# EAGLE design FSAE (EAGLE 8.3.1)
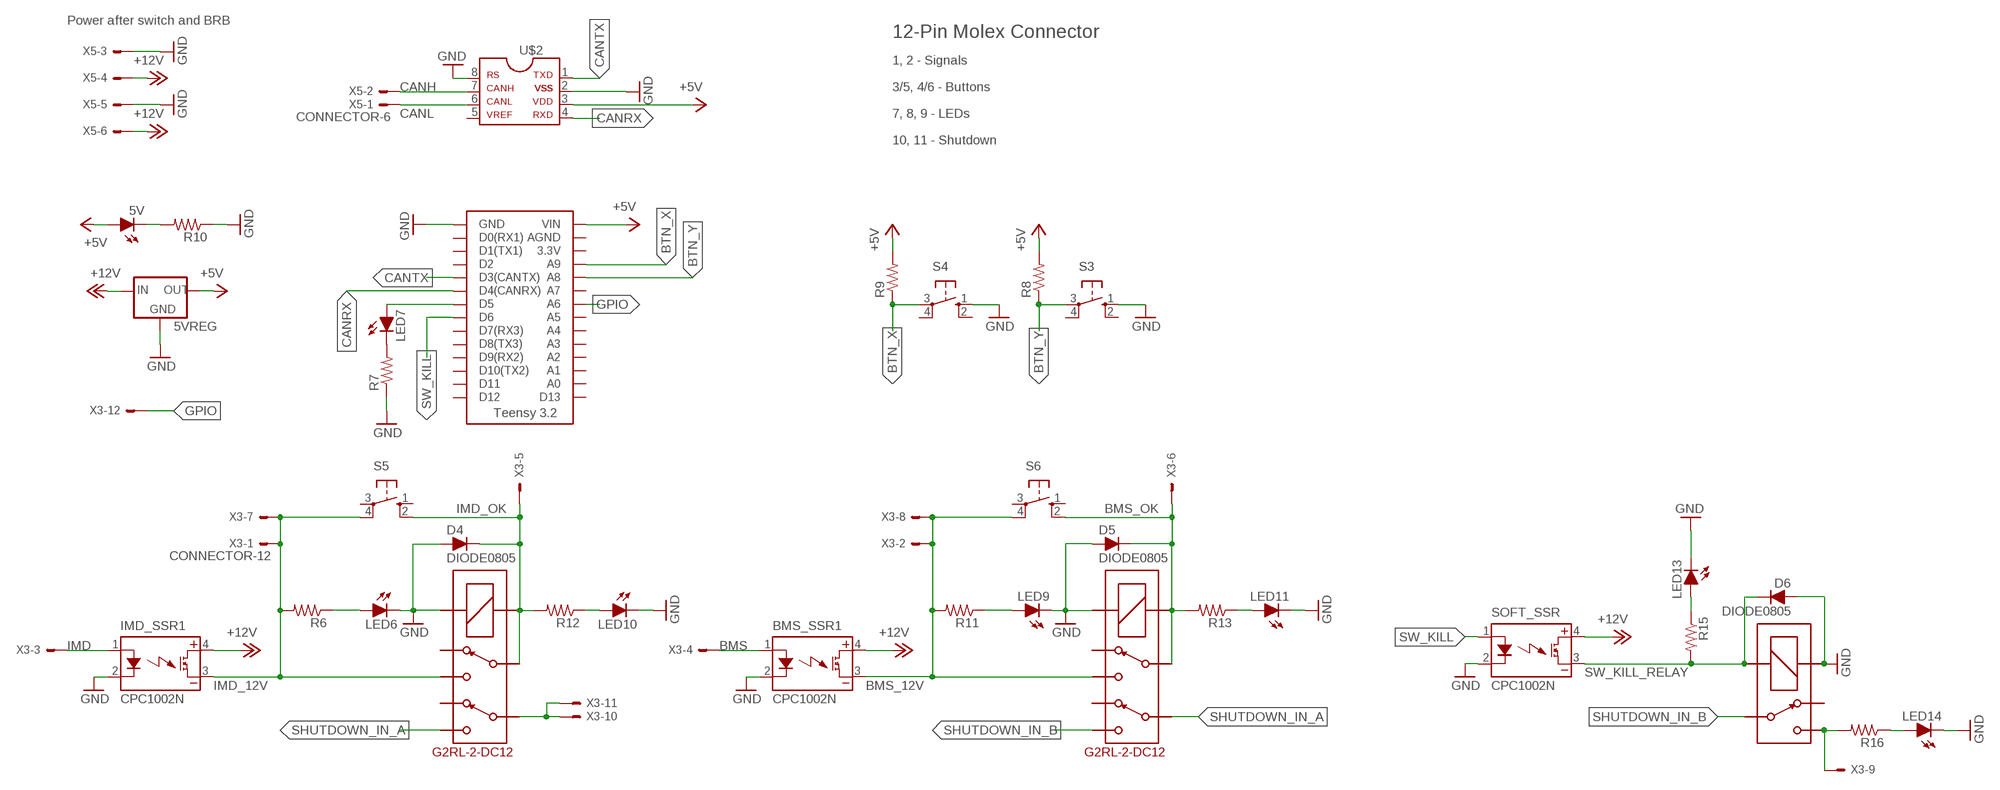
[diagram p0: schematic, sheet 1]

## Parts
5V  LED-0805  [LED-805]
5VREG  5VREG_LM340-NLM340MPX-5.0/NOPB  [SOT223]
BMS_SSR1  CPC1002N  [SOP04]
D4  DIODE0805  [0805_D]
D5  DIODE0805  [0805_D]
D6  DIODE0805  [0805_D]
IMD_SSR1  CPC1002N  [SOP04]
LED6  LED-0805  [LED-805]
LED7  LED-0805  [LED-805]
LED9  LED-0805  [LED-805]
LED10  LED-0805  [LED-805]
LED11  LED-0805  [LED-805]
LED13  LED-0805  [LED-805]
LED14  LED-0805  [LED-805]
R6  RESISTOR0805-RES  [0805]
R7  RESISTOR0805-RES  [0805]
R8  RESISTOR0402  [0402-RES]
R9  RESISTOR0402  [0402-RES]
R10  RESISTOR0805-RES  [0805]
R11  RESISTOR0805-RES  [0805]
R12  RESISTOR0805-RES  [0805]
R13  RESISTOR0805-RES  [0805]
R15  RESISTOR0805-RES  [0805]
R16  RESISTOR0805-RES  [0805]
S3  BTN_10-XX  [B3F-10XX]
S4  BTN_10-XX  [B3F-10XX]
S5  BTN_10-XX  [B3F-10XX]
S6  BTN_10-XX  [B3F-10XX]
SOFT_SSR  CPC1002N  [SOP04]
U$1  TEENSY_3.2_SIMPLE  [TEENSY_3.2_SIMPLE]
U$2  MCP2551  [SOIC-08]
U$6  G2RL-2-DC12  [G2RL-2]
U$7  G2RL-2-DC12  [G2RL-2]
U$8  G5LE  [ZF112]
X3  CONNECTOR-12  [MINIFIT_5566-12]
X5  CONNECTOR-6  [MINIFIT_5566-6]

## Nets
+5V: 5V.A 5VREG.3(OUT) R8.2 R9.2 U$1.VIN U$2.3
+12V: 5VREG.1(IN) BMS_SSR1.4(DC+) IMD_SSR1.4(DC+) SOFT_SSR.4(DC+) X5.4 X5.6
BMS: BMS_SSR1.1(CONTROL+) X3.4
BMS_12V: BMS_SSR1.3(DC-) R11.2 S6.4(P1) U$7.4 X3.2 X3.8
BMS_OK: D5.C R13.2 S6.2(S1) U$7.3 U$7.COIL- X3.6
BTN_X: R9.1 S4.3(P) U$1.A9
BTN_Y: R8.1 S3.3(P) U$1.A8
CANH: U$2.7 X5.2
CANL: U$2.6 X5.1
CANRX: U$1.D4(CANRX) U$2.4
CANTX: U$1.D3(CANTX) U$2.1
GND: 5VREG.2(GND) 5VREG.4(GND) BMS_SSR1.2(CONTROL-) D4.A D5.A D6.A IMD_SSR1.2(CONTROL-) LED6.C LED9.C LED10.C LED11.C LED13.C LED14.C R7.1 R10.1 S3.1(S) S4.1(S) SOFT_SSR.2(CONTROL-) U$1.GND U$2.2 U$2.8 U$6.COIL+ U$7.COIL+ U$8.1(COIL+) X5.3 X5.5
GPIO: U$1.A6 X3.12
IMD: IMD_SSR1.1(CONTROL+) X3.3
IMD_12V: IMD_SSR1.3(DC-) R6.2 S5.4(P1) U$6.4 X3.1 X3.7
IMD_OK: D4.C R12.2 S5.2(S1) U$6.3 U$6.COIL- X3.5
N$2: LED7.A U$1.D5
N$3: 5V.C R10.2
N$4: U$6.6 X3.10 X3.11
N$6: LED6.A R6.1
N$7: LED9.A R11.1
N$8: LED10.A R12.1
N$10: LED7.C R7.2
N$12: LED11.A R13.1
N$13: LED14.A R16.1
N$14: LED13.A R15.1
SHUTDOWN_IN_A: U$6.5 U$7.6
SHUTDOWN_IN_B: U$7.5 U$8.P
SHUTDOWN_OUT: R16.2 U$8.S X3.9
SW_KILL: SOFT_SSR.1(CONTROL+) U$1.D6
SW_KILL_RELAY: D6.C R15.2 SOFT_SSR.3(DC-) U$8.2(COIL-)
Unconnected: S3.2(S1) S3.4(P1) S4.2(S1) S4.4(P1) S5.1(S) S5.3(P) S6.1(S) S6.3(P) U$1.3.3V U$1.A0 U$1.A1 U$1.A2 U$1.A3 U$1.A4 U$1.A5 U$1.A7 U$1.AGND U$1.D0(RX1) U$1.D1(TX1) U$1.D2 U$1.D7(RX3) U$1.D8(TX3) U$1.D9(RX2) U$1.D10(TX2) U$1.D11 U$1.D12 U$1.D13 U$2.5 U$6.2 U$6.7 U$7.2 U$7.7 U$8.O

## Notes on the sheet
- Power after switch and BRB
- 12-Pin Molex Connector
- 1, 2 - Signals
- 3/5, 4/6 - Buttons
- 7, 8, 9 - LEDs
- 10, 11 - Shutdown

## Library data of the parts
5V LED6 LED7 LED9-LED11 LED13 LED14 = HyTechDevices:LED: Light Emitting Diode (LED) Source: Dangerous Prototypes Eagle Library <https://github.com/DangerousPrototypes/Eagle_Part_Library>
5VREG = HyTechDevices:5VREG_LM340-N: Voltage Regulator 5v linear voltage regulator Datasheet <http://www.mouser.com/ProductDetail/Texas-Instruments/LM340MPX-50-NOPB/?qs=X1J7HmVL2ZGZwtTFRQ9ItA%3D%3D> MAX current out: 1.5A MAX voltage in: 35V
BMS_SSR1 IMD_SSR1 SOFT_SSR = HyTechDevices:CPC1002N: IXYS Solid State Relay .7A
D4-D6 = HyTechDevices:DIODE: DIODE general purpose rectifier
R6-R13 R15 R16 = HyTechDevices:RESISTOR: Resistor Basic schematic elements and footprints for 0603, 1206, and PTH resistors.
S3-S6 = HyTechDevices:BTN_10-XX: Small momentary tactile push button; MPN: B3F-1000; OC_FARNELL: 176432; OC_NEWARK: 36M3542
U$1 = HyTechDevices:TEENSY_3.2_SIMPLE: Simple version of the Teensy 3.2 board that only uses the 2 main rows of pins, not the inner pins or the pins opposite the usb port.
U$2 = HyTechDevices:MCP2551: MCP2551 High-Speed CAN Transceiver Product Webpage <https://www.microchip.com/wwwproducts/en/MCP2551> Datasheet <http://ww1.microchip.com/downloads/en/DeviceDoc/21667f.pdf> This device is outdated It is replaced by MCP2561. Comparison Page <https://www.microchip.com/wwwproducts/ProductCompare/MCP2551/MCP2561> Product Webpage <https://www.microchip.com/wwwproducts/en/MCP2561> Datasheet <http://ww1.microchip.com/downloads/en/DeviceDoc/20005167C.pdf>
U$6 U$7 = HyTechDevices:G2RL-2-DC12: Omron G2RL-2 Double Pull Double Throw Relay Coil Voltage: 12VDC (8.4-18VDC @60ºC) Contact Amperage: 8A at 30VDC Datasheet <https://www.omron.com/ecb/products/pdf/en-g2rl.pdf>
U$8 = HyTechDevices:G5LE: Omron G5LE SPST Relay 5 VDC, 12VDC, 24VDC models Coil voltage: 75% - 170% of nominal voltage Datasheet <https://www.omron.com/ecb/products/pdf/en-g5le.pdf>
X3 = HyTechDevices:CONNECTOR-12: Mini-Fit Junior connector 12 pole Source: http://www.molex.com; OC_FARNELL: unknown; OC_NEWARK: unknown
X5 = HyTechDevices:CONNECTOR-6: Mini-Fit Junior connector 6 pole Source: http://www.molex.com; MPN: 95566-61002; OC_FARNELL: unknown; OC_NEWARK: 22K8620

## Board
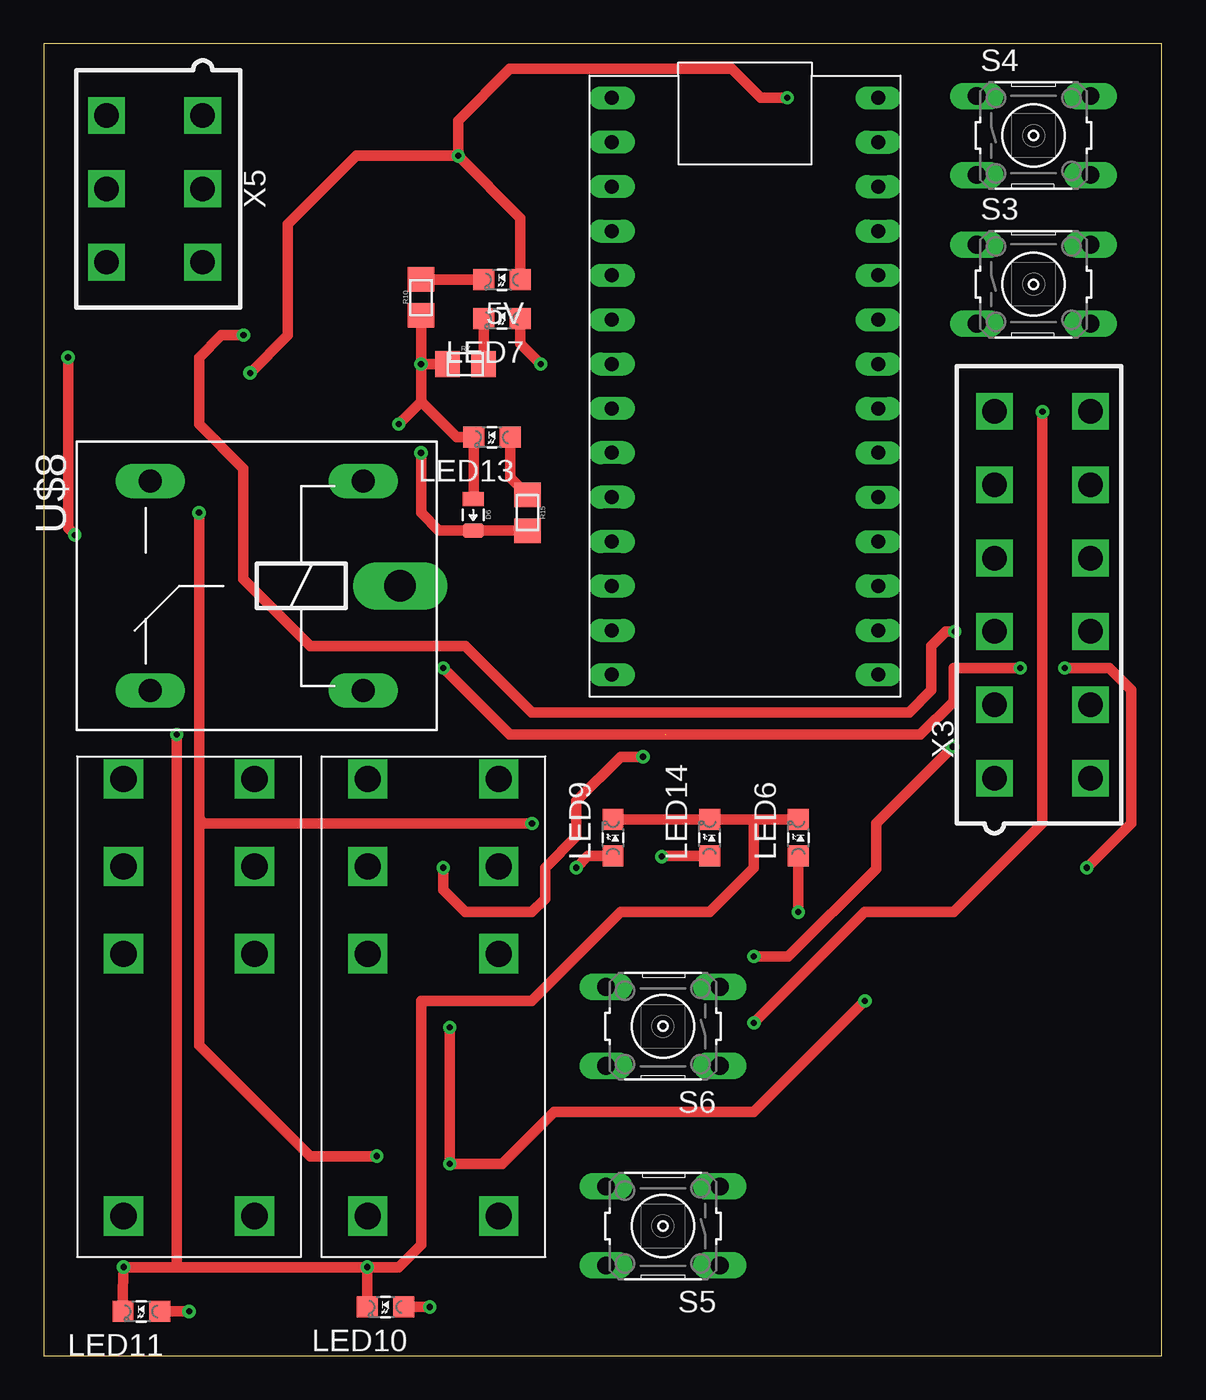
[diagram p1: board, top side]
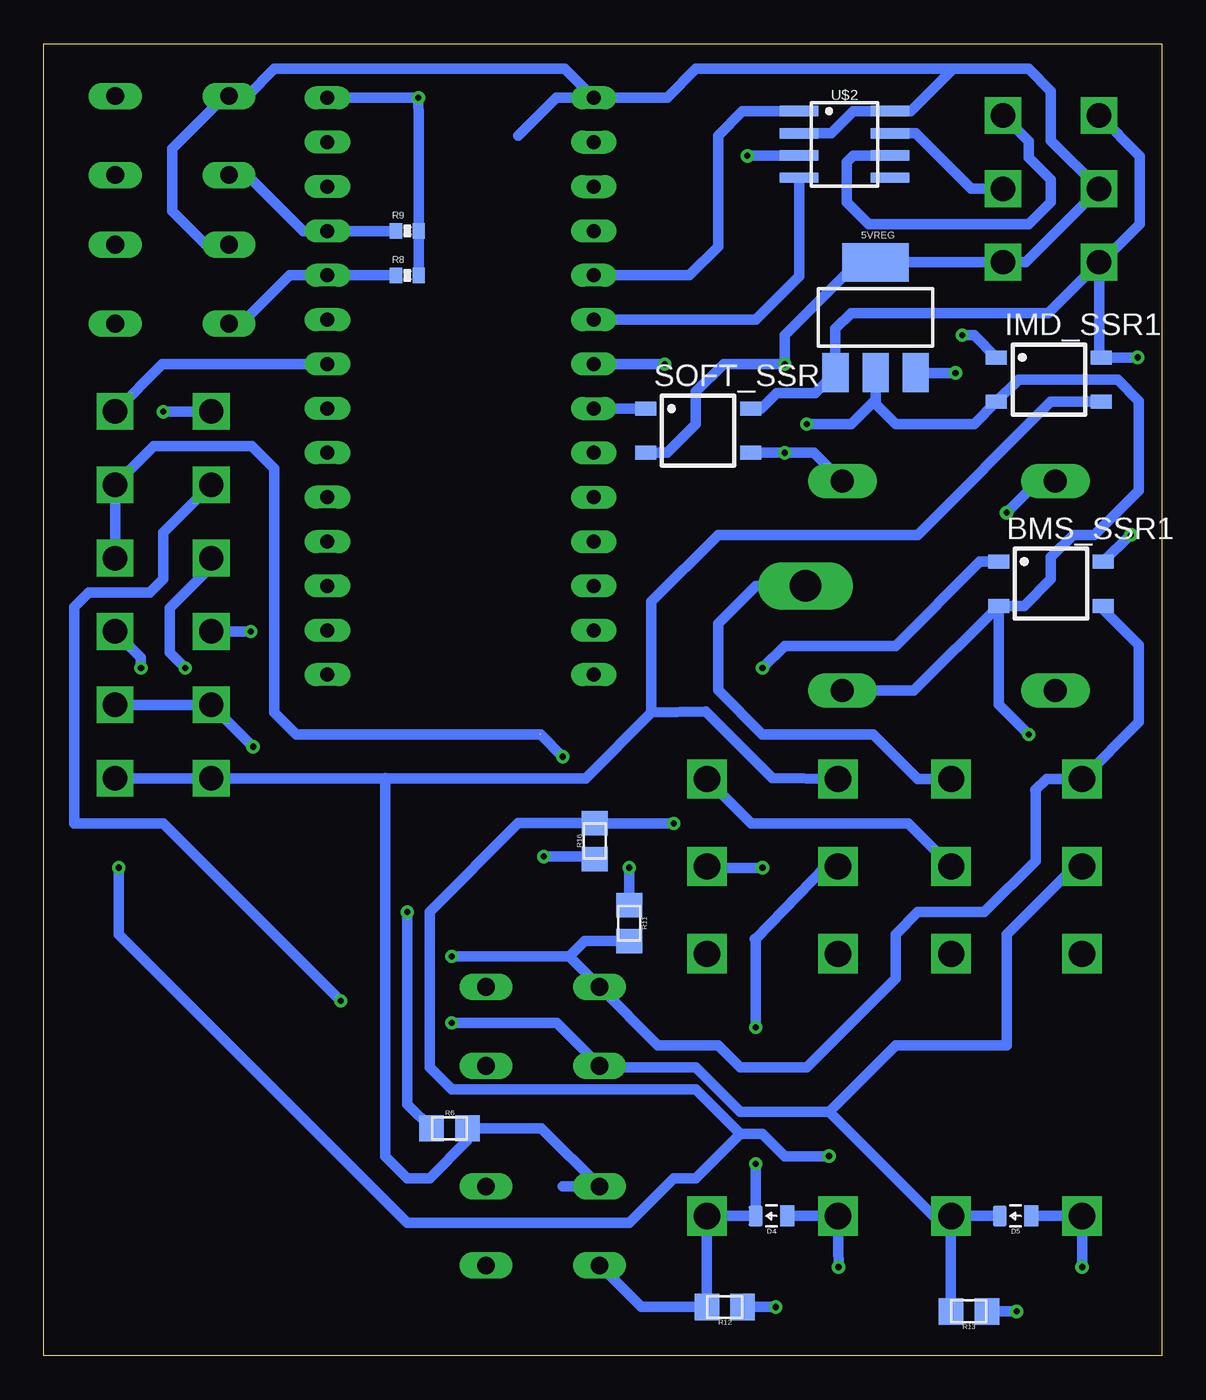
[diagram p2: board, bottom side, seen from below]

Size 63.99 x 75.11 mm. Coordinates in mm from the lower left corner, seen from the top.
Outline: 0,0 63.99,0 63.99,75.11 0,75.11 0,0
Copper layers (1*16): Top 0.035mm / dielectric 1.5mm / Bottom 0.035mm
Design rules "default": minimum track width 10mil, minimum drill 24mil, track to track 8mil, track to pad 8mil, pad to pad 8mil, via to via 8mil, smd to smd 8mil, copper to edge 40mil, drill to drill 8mil, minimum pad ring 10mil, minimum via ring 8mil, stop-mask expansion 4mil, vias tented up to drill 0mil, thermal gap 10mil

### Footprints (pad centres in the part's own frame; a part is rotated, then mirrored left to right if it is on the bottom)
LED-805 = smd 1.2 x 1.2: A 0,-1.05; C 0,1.05
SOT223 = smd 1.5 x 2.235: 1 -2.3,-3.15; 2 0,-3.15; 3 2.3,-3.15 | smd 3.8 x 2.2: 4 0,3.15
SOP04 = smd 0.8 x 1.2: 1 -1.27,-3; 2 1.27,-3; 3 1.27,3; 4 -1.27,3
0805_D = smd 0.8 x 1.2: A -0.9,0; C 0.9,0
0805 = smd 1.4 x 1.5: 1 -1.025,0; 2 1.025,0
0402-RES = smd 0.7 x 0.9: 1 -0.65,0; 2 0.65,0
B3F-10XX = drill 1.016 long: 1 -3.251,2.261; 2 3.251,2.261; 3 -3.251,-2.261; 4 3.251,-2.261
TEENSY_3.2_SIMPLE = drill 0.8 long: 3.3V 16.51,29.21; A0 16.51,3.81; A1 16.51,6.35; A2 16.51,8.89; A3 16.51,11.43; A4 16.51,13.97; A5 16.51,16.51; A6 16.51,19.05; A7 16.51,21.59; A8 16.51,24.13; A9 16.51,26.67; AGND 16.51,31.75; D0(RX1) 1.27,31.75; D1(TX1) 1.27,29.21; D2 1.27,26.67; D3(CANTX) 1.27,24.13; D4(CANRX) 1.27,21.59; D5 1.27,19.05; D6 1.27,16.51; D7(RX3) 1.27,13.97; D8(TX3) 1.27,11.43; D9(RX2) 1.27,8.89; D10(TX2) 1.27,6.35; D11 1.27,3.81; D12 1.27,1.27; D13 16.51,1.27; GND 1.27,34.29; VIN 16.51,34.29
SOIC-08 = smd 0.6 x 2.2: 1 -1.905,-2.6; 2 -0.635,-2.6; 3 0.635,-2.6; 4 1.905,-2.6; 5 1.905,2.6; 6 0.635,2.6; 7 -0.635,2.6; 8 -1.905,2.6
G2RL-2 = drill 1.5 square: 2 10.008,0; 3 5.004,0; 4 0,0; 5 0,7.493; 6 5.004,7.493; 7 10.008,7.493; COIL+ 25.019,0; COIL- 25.019,7.493
ZF112 = drill 1.321 long: 1 4.064,14.884; 2 4.064,2.896; O 16.256,14.884; S 16.256,2.896 | drill 1.803 long: P 1.956,8.89
MINIFIT_5566-12 = drill 1.4 square: 1 10.5,-2.75; 2 6.3,-2.75; 3 2.1,-2.75; 4 -2.1,-2.75; 5 -6.3,-2.75; 6 -10.5,-2.75; 7 10.5,2.75; 8 6.3,2.75; 9 2.1,2.75; 10 -2.1,2.75; 11 -6.3,2.75; 12 -10.5,2.75
MINIFIT_5566-6 = drill 1.4 square: 1 4.2,-2.75; 2 0,-2.75; 3 -4.2,-2.75; 4 4.2,2.75; 5 0,2.75; 6 -4.2,2.75

### Placement (x,y rotation side)
5V  26.23,61.59 90 top
5VREG  16.38,59.44 0 bottom
BMS_SSR1  6.35,44.2 270 bottom
D4  22.35,8 180 bottom
D5  8.38,8 180 bottom
D6  24.57,48.13 270 top
IMD_SSR1  6.48,55.88 270 bottom
LED6  43.18,29.65 0 top
LED7  26.23,59.37 90 top
LED9  32.58,29.65 0 top
LED10  19.56,2.79 90 top
LED11  5.59,2.54 90 top
LED13  25.65,52.58 90 top
LED14  38.1,29.65 0 top
R6  40.77,13.02 0 bottom
R7  24.13,56.77 0 top
R8  43.18,61.85 0 bottom
R9  43.18,64.39 0 bottom
R10  21.59,60.58 90 top
R11  30.48,24.77 270 bottom
R12  25.02,2.79 180 bottom
R13  11.05,2.54 180 bottom
R15  27.69,48.26 270 top
R16  32.45,29.46 90 bottom
S3  56.64,61.34 0 top
S4  56.64,69.85 0 top
S5  35.43,7.43 180 top
S6  35.43,18.86 180 top
SOFT_SSR  26.54,52.96 270 bottom
U$1  31.24,37.72 0 top
U$2  18.16,69.34 270 bottom
U$6  18.54,33.02 270 top
U$7  4.57,33.02 270 top
U$8  22.35,52.96 180 top
X3  57.15,43.56 270 top
X5  6.35,66.8 90 top

### Tracks (layer width: path | path; a pad name or v marks a point on that pad's centre or on a via)
+5V  (via drill 0.35)
  Top 0.61: v42.55,72.01 41.02,72.01 39.37,73.66 26.67,73.66 23.72,70.71 v23.72,68.69 | v23.72,68.69 17.89,68.69 13.97,64.77 13.97,58.42 v11.81,56.26 | v23.72,68.69 27.28,65.13 5V.A
  Bottom 0.61: 13.97,56.29 5VREG.3 14.06,56.26 v11.81,56.26 | R8.2 R9.2 42.53,70.72 v42.55,72.01 U$1.VIN | v23.72,68.69 23.7,68.71 U$2.3
+12V  (via drill 0.35)
  Top 0.61: v1.78,46.99 1.39,47.37 v1.39,57.15
  Bottom 0.61: X5.4 1.27,68.67 1.27,64.77 3.44,62.6 X5.6 | SOFT_SSR.4 22.92,54.23 22.04,55.12 19.85,55.12 5VREG.1 18.68,58.79 17.78,59.69 6.51,59.69 X5.6 | X5.6 3.6,57.27 IMD_SSR1.4 v1.39,57.15 | BMS_SSR1.4 1.83,46.99 v1.78,46.99
BMS  (via drill 0.35)
  Top 0.61: v22.86,39.37 26.67,35.56 50.16,35.56 52.07,37.47 52.07,39.37 v55.88,39.37
  Bottom 0.61: BMS_SSR1.1 10.41,45.47 15.24,40.64 21.59,40.64 v22.86,39.37 | X3.4 54.4,45.17 56.77,42.8 56.77,40.26 v55.88,39.37
BMS_12V  (via drill 0.35)
  Top 0.61: v40.64,22.86 42.61,22.86 47.62,27.88 47.62,30.48 v52.01,34.86
  Bottom 0.61: X3.8 X3.2 v52,34.86 v52.01,34.86 | BMS_SSR1.3 3.35,42.72 1.32,40.69 1.32,36.27 U$7.4 6.6,33.02 7.24,32.39 7.23,32.38 7.23,28.33 10.16,25.4 13.97,25.4 15.24,24.13 15.24,21.59 20.32,16.51 24.13,16.51 25.4,17.78 28.84,17.78 S6.4 33.92,22.86 | 33.92,22.86 v40.64,22.86 | R11.2 33.04,23.74 33.92,22.86
BMS_OK  (via drill 0.35)
  Top 0.61: v57.15,54.04 57.15,30.48 52.07,25.4 46.99,25.4 v40.64,19.05
  Bottom 0.61: D5.C U$7.COIL- | U$7.COIL- R13.2 | X3.6 55.16,54.06 v57.15,54.04 | v40.64,19.05 34.63,19.05 S6.2 32.09,16.51 26.67,16.51 24.13,13.97 19.05,13.97 | U$7.3 5,28.02 8.89,24.13 8.89,17.78 15.24,17.78 19.05,13.97 | U$7.COIL- 13.08,8 19.05,13.97
BTN_X
  Bottom 0.61: S4.3 52.35,67.59 49.15,64.39 47.85,64.39 U$1.A9 R9.1
BTN_Y
  Bottom 0.61: S3.3 52.68,59.08 49.91,61.85 U$1.A8 R8.1
CANH
  Bottom 0.61: X5.2 10.92,66.8 14.1,69.98 U$2.7
CANL
  Bottom 0.61: U$2.6 17.65,68.71 18.03,68.33 18.03,66.04 16.76,64.77 7.62,64.77 6.35,66.04 6.35,67.31 7.62,68.58 7.62,69.52 X5.1
CANRX
  Bottom 0.61: U$2.4 20.76,61.79 23.24,59.31 U$1.D4(CANRX)
CANTX
  Bottom 0.61: U$1.D3(CANTX) 27.05,61.85 25.4,63.5 25.4,69.85 24,71.25 U$2.1
GND  (via drill 0.35)
  Top 0.61: v21.59,56.77 R7.1 | 21.59,54.61 v21.59,56.77 | 21.59,54.61 v20.32,53.34 | D6.A 24.6,49.06 LED13.C 23.62,52.58 21.59,54.61 | LED11.C 4.54,3.81 v4.57,5.08 7.46,5.08 | LED10.C v18.51,5.08 | 7.46,5.08 v18.51,5.08 | R10.1 v21.59,56.77 | 40.46,30.7 LED14.C LED9.C | 40.46,30.7 LED6.C | v18.51,5.08 20.32,5.08 21.59,6.35 21.59,20.32 27.94,20.32 33.02,25.4 38.1,25.4 40.64,27.94 40.64,30.52 40.46,30.7 | v7.62,35.56 7.62,5.24 7.46,5.08
  Bottom 0.61: X5.3 7.8,62.6 X5.5 6.35,69.55 6.35,72.39 7.62,73.66 11.96,73.66 | U$2.2 18.92,69.98 17.65,71.25 U$2.8 14.37,71.25 11.96,73.66 | 11.96,73.66 26.67,73.66 28.32,72.01 U$1.GND | 5VREG.2 16.38,54.74 | 16.38,54.74 17.78,53.34 v20.32,53.34 | U$1.GND 34.16,73.66 50.8,73.66 52.35,72.11 S4.1 53.62,72.11 56.64,69.09 56.64,65.53 54.71,63.6 S3.1 53.45,63.54 | SOFT_SSR.2 28.32,51.69 26.67,53.34 26.67,55.18 25.08,56.77 v21.59,56.77 21.59,58.42 17.42,62.59 5VREG.4 16.37,62.6 X5.3 | 16.38,54.74 16.38,54.48 15.24,53.34 10.75,53.34 IMD_SSR1.2 8.21,55.88 2.54,55.88 1.32,54.66 1.32,49.53 3.86,46.99 5.08,46.99 6.35,45.72 6.35,44.45 7.87,42.93 BMS_SSR1.2 | 9.11,62.61 X5.3 | BMS_SSR1.2 14.2,38.08 U$8.1 | D5.A U$7.COIL+ v4.57,5.08 | D4.A U$6.COIL+ 18.54,7.4 v18.51,5.08 | U$1.GND 34.67,72.01 36.83,69.85 | BMS_SSR1.2 9.35,37.29 v7.62,35.56
GPIO
  Bottom 0.61: U$1.A6 57.19,56.77 X3.12
IMD  (via drill 0.35)
  Top 0.61: v11.43,58.42 10.16,58.42 8.89,57.15 8.89,53.34 11.43,50.8 11.43,44.45 15.24,40.64 24.13,40.64 27.94,36.83 49.53,36.83 50.8,38.1 50.8,40.64 51.63,41.47 v52.13,41.47
  Bottom 0.61: IMD_SSR1.1 10.75,58.42 v11.43,58.42 | v52.13,41.47 v52.14,41.46 X3.3
IMD_12V
  Bottom 0.61: X3.7 X3.1 43.3,33.06 | IMD_SSR1.3 6.35,54.61 13.97,46.99 25.4,46.99 29.21,43.18 29.21,36.83 | 29.21,36.83 32.98,33.06 43.3,33.06 | U$6.4 22.29,33.08 26.1,36.89 29.21,36.83 | 43.3,33.06 44.45,33.07 44.45,11.43 43.18,10.16 41.91,10.16 39.74,12.33 R6.2 35.51,13.02 S5.4 34.27,9.69
IMD_OK  (via drill 0.35)
  Top 0.61: v23.24,18.8 v23.24,10.99 26.23,10.99 29.21,13.97 40.64,13.97 v46.99,20.32
  Bottom 0.61: 25.98,8 D4.C | 25.98,8 U$6.COIL- | 25.98,8 26.04,7.94 R12.2 29.81,2.79 S5.2 | U$6.3 19.23,28.02 23.24,23.88 | 23.3,8.05 D4.C | v23.24,18.8 23.24,23.88 | D4.C 23.25,8.01 v23.24,10.99 | 23.24,23.88 23.3,23.88 | X3.5 57.15,47.11 57.15,44.45 57.91,43.69 61.4,43.69 62.23,42.86 62.23,30.48 57.15,30.48 v46.99,20.32
N$2  (via drill 0.35)
  Top 0.61: LED7.A 27.28,57.94 v28.45,56.77
  Bottom 0.61: v28.45,56.77 U$1.D5
N$3
  Top 0.61: 5V.C R10.2
N$4  (via drill 0.35)  (1 unrouted)
  Top 0.61: v22.86,27.94 22.86,26.67 24.13,25.4 27.94,25.4 28.7,26.16 28.7,27.94 30.48,29.72 30.48,31.75 33.02,34.29 v34.29,34.29
  Bottom 0.61: X3.10 X3.11 57.69,52.07 52.07,52.07 50.8,50.8 50.8,36.83 49.53,35.56 35.62,35.56 | U$6.6 25.96,27.94 v22.86,27.94 | 35.56,35.56 v34.29,34.29
N$6  (via drill 0.35)
  Top 0.61: LED6.A v43.18,25.4
  Bottom 0.61: R6.1 43.18,14.41 v43.18,25.4
N$7  (via drill 0.35)
  Top 0.61: v30.48,27.94 31.14,28.6 LED9.A
  Bottom 0.61: R11.1 v30.48,27.94
N$8  (via drill 0.35)
  Top 0.61: LED10.A v22.1,2.79
  Bottom 0.61: R12.1 v22.1,2.79
N$10
  Top 0.61: LED7.C 25.18,56.79 R7.2
N$12  (via drill 0.35)
  Top 0.61: LED11.A v8.32,2.54
  Bottom 0.61: R13.1 v8.32,2.54
N$13  (via drill 0.35)
  Top 0.61: LED14.A 35.4,28.6 v35.37,28.57
  Bottom 0.61: v35.37,28.57 32.58,28.57 R16.1
N$14
  Top 0.61: R15.1 26.7,50.27 LED13.A
SHUTDOWN_IN_A
  Bottom 0.61: U$7.6 14.53,30.48 23.5,30.48 U$6.5
SHUTDOWN_IN_B
  Bottom 0.61: U$7.5 13.97,33.02 16.51,35.56 22.86,35.56 25.4,38.1 25.4,41.91 23.24,44.07 U$8.P
SHUTDOWN_OUT  (via drill 0.35)
  Top 0.61: 8.89,30.75 8.89,17.78 15.24,11.43 v19.05,11.43 | v59.69,27.94 62.23,30.48 62.23,38.1 60.96,39.37 v58.42,39.37 | 8.89,30.75 9.16,30.48 v27.94,30.48 | v8.89,48.26 8.89,30.75
  Bottom 0.61: U$8.S 7.09,50.06 v8.89,48.26 | v27.94,30.48 R16.2 36.82,30.49 41.91,25.4 41.91,16.51 40.64,15.24 26.67,15.24 24.13,12.7 | v19.05,11.43 21.59,11.43 22.86,12.7 24.13,12.7 | 24.13,12.7 26.67,10.16 27.94,10.16 30.48,7.62 43.18,7.62 59.69,24.13 v59.69,27.94 | X3.9 58.42,39.98 v58.42,39.37
SW_KILL
  Bottom 0.61: SOFT_SSR.1 U$1.D6
SW_KILL_RELAY  (via drill 0.35)
  Top 0.61: v21.59,51.69 21.59,48.26 22.62,47.23 D6.C R15.2
  Bottom 0.61: U$8.2 19.91,51.69 v21.59,51.69 SOFT_SSR.3

### Text on the board
tDocu: 5V